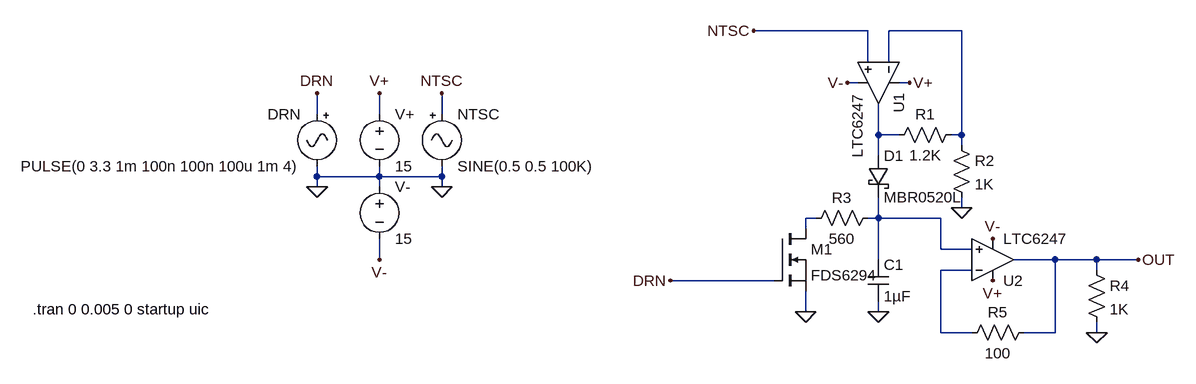
[diagram p0: schematic peakDetector.asc]
peakDetector.asc, the LTspice schematic file:
Version 4
SHEET 1 1308 680
WIRE 816 0 640 0
WIRE 960 0 848 0
WIRE 816 48 816 0
WIRE 848 48 848 0
WIRE 800 80 784 80
WIRE 880 80 864 80
WIRE -32 128 -32 96
WIRE 64 128 64 96
WIRE 160 128 160 96
WIRE 832 160 832 112
WIRE 864 160 832 160
WIRE 960 160 960 0
WIRE 960 160 944 160
WIRE 960 176 960 160
WIRE 832 192 832 160
WIRE -32 224 -32 208
WIRE 64 224 64 208
WIRE 64 224 -32 224
WIRE 160 224 160 208
WIRE 160 224 64 224
WIRE -32 240 -32 224
WIRE 64 240 64 224
WIRE 160 240 160 224
WIRE 960 272 960 256
WIRE 736 288 720 288
WIRE 832 288 832 256
WIRE 832 288 816 288
WIRE 928 288 832 288
WIRE 720 304 720 288
WIRE 928 336 928 288
WIRE 976 336 928 336
WIRE 64 352 64 320
WIRE 832 352 832 288
WIRE 1104 352 1040 352
WIRE 1168 352 1104 352
WIRE 1232 352 1168 352
WIRE 976 368 928 368
WIRE 1168 368 1168 352
WIRE 672 384 512 384
WIRE 720 432 720 400
WIRE 832 432 832 416
WIRE 928 464 928 368
WIRE 976 464 928 464
WIRE 1104 464 1104 352
WIRE 1104 464 1056 464
WIRE 1168 464 1168 448
FLAG -32 240 0
FLAG 160 240 0
FLAG -32 96 DRN
FLAG 64 96 V+
FLAG 64 352 V-
FLAG 160 96 NTSC
FLAG 640 0 NTSC
FLAG 880 80 V+
FLAG 784 80 V-
FLAG 960 272 0
FLAG 832 432 0
FLAG 720 432 0
FLAG 512 384 DRN
FLAG 1008 384 V+
FLAG 1008 320 V-
FLAG 1232 352 OUT
FLAG 1168 464 0
SYMBOL voltage 64 112 R0
SYMATTR InstName V+
SYMATTR Value 15
SYMBOL voltage 64 224 R0
SYMATTR InstName V-
SYMATTR Value 15
SYMBOL Misc\\signal 160 112 R0
WINDOW 123 0 0 Left 2
WINDOW 39 0 0 Left 2
SYMATTR InstName NTSC
SYMATTR Value SINE(0.5 0.5 100K)
SYMBOL Misc\\signal -32 112 M0
WINDOW 123 0 0 Left 2
WINDOW 39 0 0 Left 2
SYMATTR InstName DRN
SYMATTR Value PULSE(0 3.3 1m 100n 100n 100u 1m 4)
SYMBOL res 960 144 R90
WINDOW 0 0 56 VBottom 2
WINDOW 3 32 56 VTop 2
SYMATTR InstName R1
SYMATTR Value 1.2K
SYMBOL res 944 160 R0
SYMATTR InstName R2
SYMATTR Value 1K
SYMBOL schottky 816 192 R0
SYMATTR InstName D1
SYMATTR Value MBR0520L
SYMATTR Description Diode
SYMATTR Type diode
SYMBOL cap 816 352 R0
SYMATTR InstName C1
SYMATTR Value 1µF
SYMBOL nmos 672 304 R0
SYMATTR InstName M1
SYMATTR Value FDS6294
SYMBOL res 1072 448 R90
WINDOW 0 0 56 VBottom 2
WINDOW 3 32 56 VTop 2
SYMATTR InstName R5
SYMATTR Value 100
SYMBOL Opamps\\LTC6247 832 80 R90
SYMATTR InstName U1
SYMBOL Opamps\\LTC6247 1008 352 M180
SYMATTR InstName U2
SYMBOL res 720 304 R270
WINDOW 0 32 56 VTop 2
WINDOW 3 0 56 VBottom 2
SYMATTR InstName R3
SYMATTR Value 560
SYMBOL res 1152 352 R0
SYMATTR InstName R4
SYMATTR Value 1K
TEXT -470 428 Left 2 !.tran 0 0.005 0 startup uic

The netlist it stands for:
* peakDetector.asc
V+ V+ 0 15
V- 0 V- 15
V§NTSC NTSC 0 SINE(0.5 0.5 100K)
V§DRN DRN 0 PULSE(0 3.3 1m 100n 100n 100u 1m 4)
R1 N001 N002 1.2K
R2 N001 0 1K
D1 N002 N004 MBR0520L
C1 N004 0 1µF
M1 N003 DRN 0 0 FDS6294
R5 OUT N005 100
* U1: LTC6247 (symbol Opamps\LTC6247 not available, pins judged from their places): In+=NTSC In-=N001 V+=V+ V-=V- OUT=N002
* U2: LTC6247 (symbol Opamps\LTC6247 not available, pins judged from their places): In+=N004 In-=N005 V+=V+ V-=V- OUT=OUT
R3 N003 N004 560
R4 OUT 0 1K
.model D D
.lib standard.dio
.model NMOS NMOS
.model PMOS PMOS
.lib standard.mos
.tran 0 0.005 0 startup uic
.backanno
.end